# EAGLE design Nebula v1 (EAGLE 6.1)

## Sheet 1 of 5
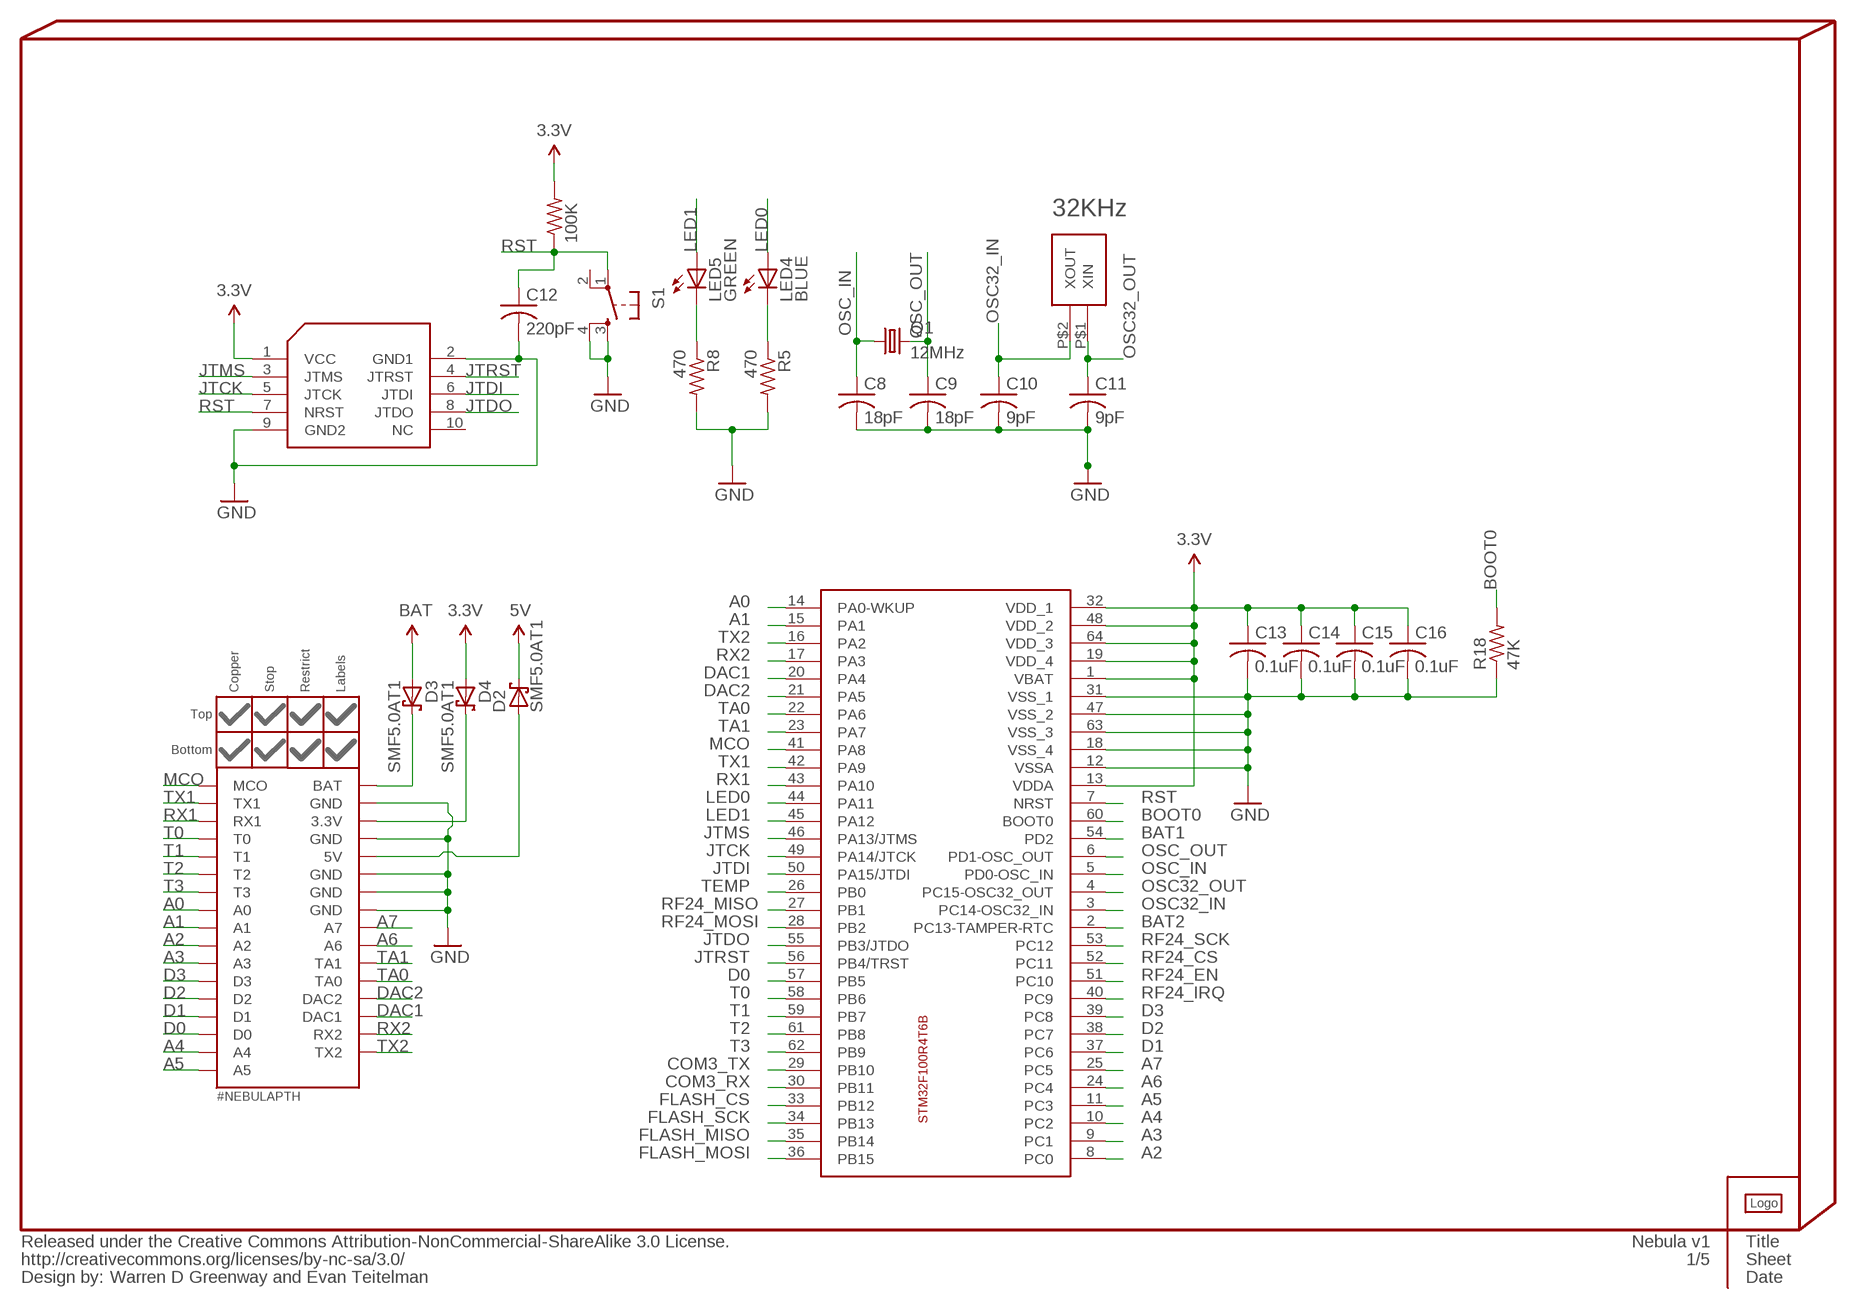
[diagram p0: schematic, sheet 1]

### Parts
C8  18pF  C-USC0402  [C0402]
C9  18pF  C-USC0402  [C0402]
C10  9pF  C-USC0402  [C0402]
C11  9pF  C-USC0402  [C0402]
C12  220pF  C-USC0402  [C0402]
C13  0.1uF  C-USC0402  [C0402]
C14  0.1uF  C-USC0402  [C0402]
C15  0.1uF  C-USC0402  [C0402]
C16  0.1uF  C-USC0402  [C0402]
D2  SMF5.0AT1  [SOD123FL]
D3  SMF5.0AT1  [SOD123FL]
D4  SMF5.0AT1  [SOD123FL]
INFO3  Warren D Greenway and Evan Teitelman  %CC-NC-SA  [%CC-NC-SA]
LED4  BLUE  LED0603  [LED-0603]
LED5  GREEN  LED0603  [LED-0603]
LOGO1  #LOGOA-THICK  [#LOGOA-THICK]
NEBULA1  #NEBULAPTH  [#NEBULA-PTH]
NEBULAPART1  #NEBULA-PARTCOPPER  [#NEBULA-COPPER]
NEBULAPART2  #NEBULA-PARTRESTRICT  [#NEBULA-RESTRICT]
NEBULAPART3  #NEBULA-PARTSTOP  [#NEBULA-STOP]
NEBULAPART4  #NEBULA-PARTLABELS-BOTTOM  [#NEBULA-LABELS-BOTT]
Q1  12MHz  CRYSTAL5X3  [CRYSTAL-SMD-5X3]
Q2  CM415  [CM415]
R3  100K  R-US_R0402  [R0402]
R5  470  R-US_R0402  [R0402]
R8  470  R-US_R0402  [R0402]
R18  47K  R-US_R0402  [R0402]
S1  TAC_SWITCHSMD  [TACTILE_SWITCH_SMD]
U3  STM32F100R4T6B  [S-PQFP64-G64]
U4  STM32-JTAG-10P  [STM32-JTAG-10P]

### Nets
3.3V: C13.1 C14.1 C15.1 C16.1 D4.A R3.2 U3.1(VBAT) U3.13(VDDA) U3.19(VDD_4) U3.32(VDD_1) U3.48(VDD_2) U3.64(VDD_3) U4.1(VCC) ; supply symbol labelled @3.3V ; also sheet 2,3,5
5V: D2.C ; supply symbol labelled @5V ; also sheet 3,4
A0: NEBULA1.A0 U3.14(PA0-WKUP)
A1: NEBULA1.A1 U3.15(PA1)
A2: NEBULA1.A2 U3.8(PC0)
A3: NEBULA1.A3 U3.9(PC1)
A4: NEBULA1.A4 U3.10(PC2)
A5: NEBULA1.A5 U3.11(PC3)
A6: NEBULA1.A6 U3.24(PC4)
A7: NEBULA1.A7 U3.25(PC5)
BAT: D3.A ; supply symbol labelled @BAT ; also sheet 3
BAT1: U3.54(PD2) ; also sheet 3
BAT2: U3.2(PC13-TAMPER-RTC) ; also sheet 3
BOOT0: R18.2 U3.60(BOOT0)
COM3_RX: U3.30(PB11) ; also sheet 4
COM3_TX: U3.29(PB10) ; also sheet 4
D0: NEBULA1.D0 U3.57(PB5)
D1: NEBULA1.D1 U3.37(PC6)
D2: NEBULA1.D2 U3.38(PC7)
D3: NEBULA1.D3 U3.39(PC8)
DAC1: NEBULA1.DAC1 U3.20(PA4)
DAC2: NEBULA1.DAC2 U3.21(PA5)
FLASH_CS: U3.33(PB12) ; also sheet 5
FLASH_MISO: U3.35(PB14) ; also sheet 5
FLASH_MOSI: U3.36(PB15) ; also sheet 5
FLASH_SCK: U3.34(PB13) ; also sheet 5
JTCK: U3.49(PA14/JTCK) U4.5(JTCK)
JTDI: U3.50(PA15/JTDI) U4.6(JTDI)
JTDO: U3.55(PB3/JTDO) U4.8(JTDO)
JTMS: U3.46(PA13/JTMS) U4.3(JTMS)
JTRST: U3.56(PB4/TRST) U4.4(JTRST)
LED0: LED4.A U3.44(PA11)
LED1: LED5.A U3.45(PA12)
MCO: NEBULA1.MCO U3.41(PA8)
N$9: C8.2 C9.2 C10.2 C11.2 C12.2 C13.2 C14.2 C15.2 C16.2 NEBULA1.GND1(GND) NEBULA1.GND2(GND) NEBULA1.GND3(GND) NEBULA1.GND4(GND) NEBULA1.GND5(GND) R5.2 R8.2 R18.1 S1.3 S1.4 U3.12(VSSA) U3.18(VSS_4) U3.31(VSS_1) U3.47(VSS_2) U3.63(VSS_3) U4.2(GND1) U4.9(GND2) ; supply symbol labelled @GND ; also sheet 2,3,4,5
N$16: D3.C NEBULA1.BAT
N$29: D4.C NEBULA1.3.3V
N$35: LED5.C R8.1
N$37: LED4.C R5.1
N$38: D2.A NEBULA1.5V
OSC32_IN: C10.1 Q2.P$2(XOUT) U3.3(PC14-OSC32_IN)
OSC32_OUT: C11.1 Q2.P$1(XIN) U3.4(PC15-OSC32_OUT)
OSC_IN: C8.1 Q1.1 U3.5(PD0-OSC_IN)
OSC_OUT: C9.1 Q1.3 U3.6(PD1-OSC_OUT)
RF24_CS: U3.52(PC11) ; also sheet 2
RF24_EN: U3.51(PC10) ; also sheet 2
RF24_IRQ: U3.40(PC9) ; also sheet 2
RF24_MISO: U3.27(PB1) ; also sheet 2
RF24_MOSI: U3.28(PB2) ; also sheet 2
RF24_SCK: U3.53(PC12) ; also sheet 2
RST: C12.1 R3.1 S1.1 U3.7(NRST) U4.7(NRST)
RX1: NEBULA1.COM1_RX(RX1) U3.43(PA10)
RX2: NEBULA1.COM2_RX(RX2) U3.17(PA3)
T0: NEBULA1.T0 U3.58(PB6)
T1: NEBULA1.T1 U3.59(PB7)
T2: NEBULA1.T2 U3.61(PB8)
T3: NEBULA1.T3 U3.62(PB9)
TA0: NEBULA1.TA0 U3.22(PA6)
TA1: NEBULA1.TA1 U3.23(PA7)
TEMP: U3.26(PB0) ; also sheet 3
TX1: NEBULA1.COM1_TX(TX1) U3.42(PA9)
TX2: NEBULA1.COM2_TX(TX2) U3.16(PA2)
Unconnected: S1.2 U4.10(NC)

## Sheet 2 of 5
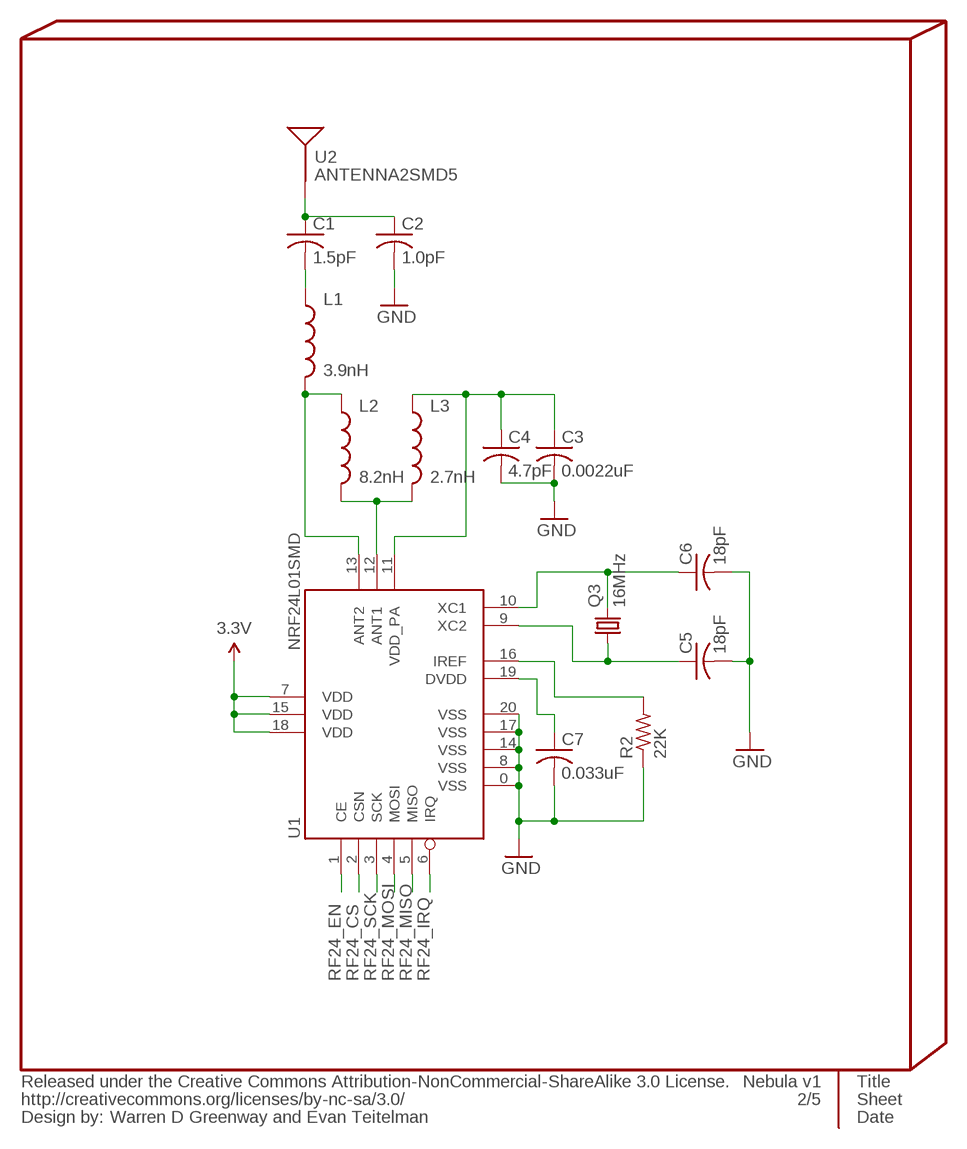
[diagram p1: schematic, sheet 2]

### Parts
C1  1.5pF  C-USC0402  [C0402]
C2  1.0pF  C-USC0402  [C0402]
C3  0.0022uF  C-USC0402  [C0402]
C4  4.7pF  C-USC0402  [C0402]
C5  18pF  C-USC0402  [C0402]
C6  18pF  C-USC0402  [C0402]
C7  0.033uF  C-USC0402  [C0402]
L1  3.9nH  INDUCTOR0402  [C0402]
L2  8.2nH  INDUCTOR0402  [C0402]
L3  2.7nH  INDUCTOR0402  [C0402]
Q3  16MHz  CRYSTAL5X3  [CRYSTAL-SMD-5X3]
R2  22K  R-US_R0402  [R0402]
U1  NRF24L01SMD  [QFN20]
U2  ANTENNA2SMD5  [ANTENNA-CHIP5]

### Nets
3.3V: U1.7(VDD) U1.15(VDD) U1.18(VDD) ; supply symbol labelled @3.3V ; also sheet 1,3,5
N$1: C1.1 C2.1 U2.FEED(SIGNAL)
N$2: C1.2 L1.1
N$3: L1.2 L2.1 U1.13(ANT2)
N$4: L2.2 L3.2 U1.12(ANT1)
N$5: C3.1 C4.1 L3.1 U1.11(VDD_PA)
N$7: C6.1 Q3.3 U1.10(XC1)
N$8: C5.1 Q3.1 U1.9(XC2)
N$9: C2.2 C3.2 C4.2 C5.2 C6.2 C7.2 R2.1 U1.0(VSS) U1.8(VSS) U1.14(VSS) U1.17(VSS) U1.20(VSS) ; supply symbol labelled @GND ; also sheet 1,3,4,5
N$10: R2.2 U1.16(IREF)
N$11: C7.1 U1.19(DVDD)
RF24_CS: U1.2(CSN) ; also sheet 1
RF24_EN: U1.1(CE) ; also sheet 1
RF24_IRQ: U1.6(IRQ) ; also sheet 1
RF24_MISO: U1.5(MISO) ; also sheet 1
RF24_MOSI: U1.4(MOSI) ; also sheet 1
RF24_SCK: U1.3(SCK) ; also sheet 1

## Sheet 3 of 5
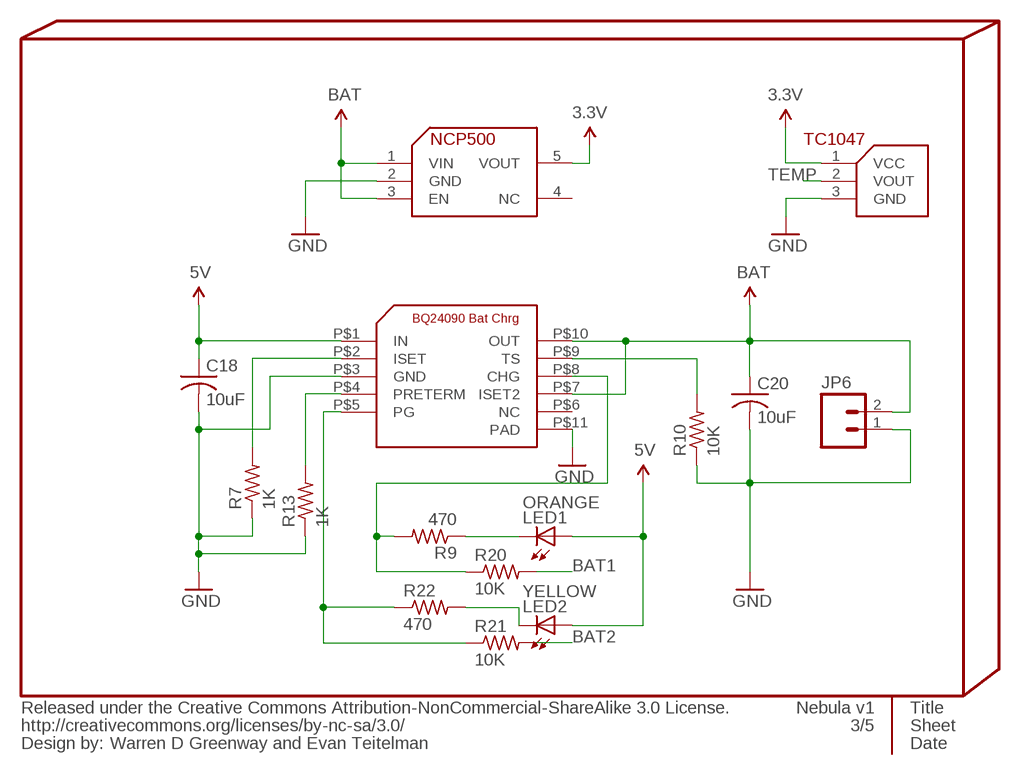
[diagram p2: schematic, sheet 3]

### Parts
C18  10uF  C-USC0805  [C0805]
C20  10uF  C-USC0805  [C0805]
JP6  M02-JST-2MM-SMT  [JST-2-SMD]
LED1  ORANGE  LED0603  [LED-0603]
LED2  YELLOW  LED0603  [LED-0603]
R7  1K  R-US_R0402  [R0402]
R9  470  R-US_R0402  [R0402]
R10  10K  R-US_R0402  [R0402]
R13  1K  R-US_R0402  [R0402]
R20  10K  R-US_R0402  [R0402]
R21  10K  R-US_R0402  [R0402]
R22  470  R-US_R0402  [R0402]
U5  MICROCHIP-TEMP-TC1047  [SOT23]
U6  BQ24090  [R-PDSO-G10]
U8  NCP500  [SOT23-5L]

### Nets
3.3V: U5.1(VCC) U8.5(VOUT) ; supply symbol labelled @3.3V ; also sheet 1,2,5
5V: C18.1 LED1.A LED2.A U6.P$1(IN) ; supply symbol labelled @5V ; also sheet 1,4
BAT: C20.1 JP6.2 U6.P$7(ISET2) U6.P$10(OUT) U8.1(VIN) U8.3(EN) ; supply symbol labelled @BAT ; also sheet 1
BAT1: R20.2 ; also sheet 1
BAT2: R21.2 ; also sheet 1
N$9: C18.2 C20.2 JP6.1 R7.1 R10.1 R13.1 U5.3(GND) U6.P$3(GND) U6.P$11(PAD) U8.2(GND) ; supply symbol labelled @GND, GND ; also sheet 1,2,4,5
N$13: R10.2 U6.P$9(TS)
N$17: R7.2 U6.P$2(ISET)
N$18: R13.2 U6.P$4(PRETERM)
N$27: R21.1 R22.1 U6.P$5(PG)
N$31: R9.2 R20.1 U6.P$8(CHG)
N$32: LED1.C R9.1
N$33: LED2.C R22.2
TEMP: U5.2(VOUT) ; also sheet 1
Unconnected: U6.P$6(NC) U8.4(NC)

## Sheet 4 of 5
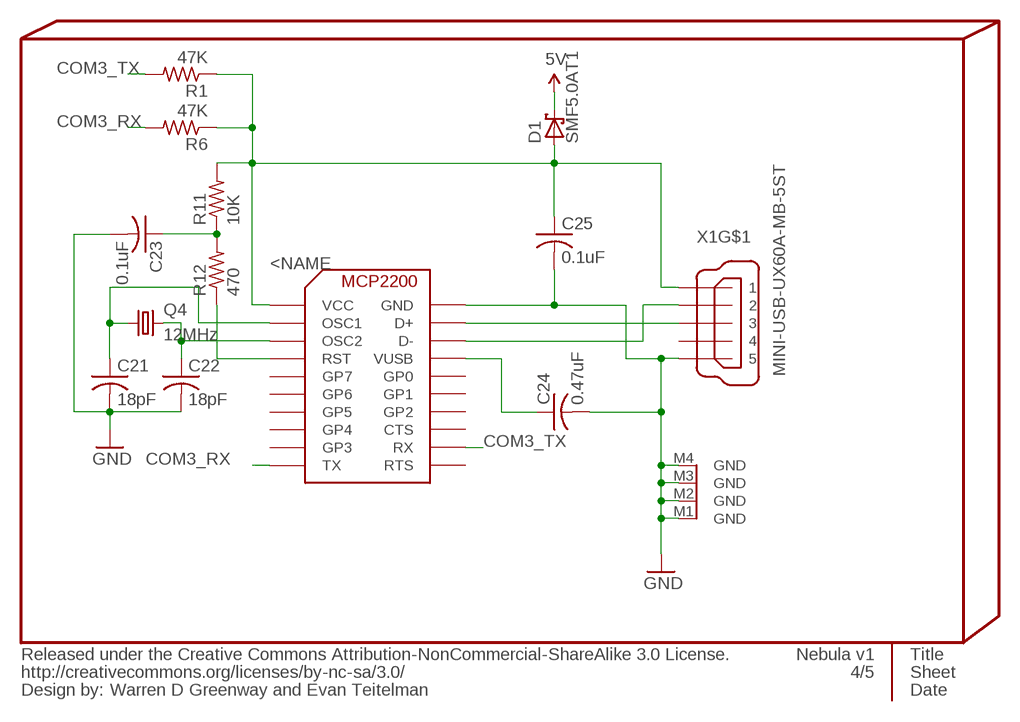
[diagram p3: schematic, sheet 4]

### Parts
C21  18pF  C-USC0402  [C0402]
C22  18pF  C-USC0402  [C0402]
C23  0.1uF  C-USC0402  [C0402]
C24  0.47uF  C-USC0402  [C0402]
C25  0.1uF  C-USC0402  [C0402]
D1  SMF5.0AT1  [SOD123FL]
Q4  12MHz  CRYSTAL5X3  [CRYSTAL-SMD-5X3]
R1  47K  R-US_R0402  [R0402]
R6  47K  R-US_R0402  [R0402]
R11  10K  R-US_R0402  [R0402]
R12  470  R-US_R0402  [R0402]
U7  MICROCHIP-USB-MCP2200  [QFN-20-5X5]
X1  MINI-USB-UX60A-MB-5ST  [UX60A-MB-5ST]

### Nets
5V: D1.C ; supply symbol labelled @5V ; also sheet 1,3
COM3_RX: R6.2 U7.P7(TX) ; also sheet 1
COM3_TX: R1.2 U7.P9(RX) ; also sheet 1
N$9: C21.2 C22.2 C23.2 C24.2 C25.2 U7.P17(GND) X1.5 X1.M1(GND) X1.M2(GND) X1.M3(GND) X1.M4(GND) ; supply symbol labelled @GND ; also sheet 1,2,3,5
N$19: C23.1 R11.1 R12.2
N$21: C22.1 Q4.3 U7.P20(OSC2)
N$22: C21.1 Q4.1 U7.P19(OSC1)
N$24: R12.1 U7.P1(RST)
N$26: U7.P15(D-) X1.2
N$28: C24.1 U7.P14(VUSB)
N$34: C25.1 D1.A R1.1 R6.1 R11.2 U7.P18(VCC) X1.1
N$36: U7.P16(D+) X1.3
Unconnected: U7.P2(GP7) U7.P3(GP6) U7.P4(GP5) U7.P5(GP4) U7.P6(GP3) U7.P8(RTS) U7.P10(CTS) U7.P11(GP2) U7.P12(GP1) U7.P13(GP0) X1.4

## Sheet 5 of 5
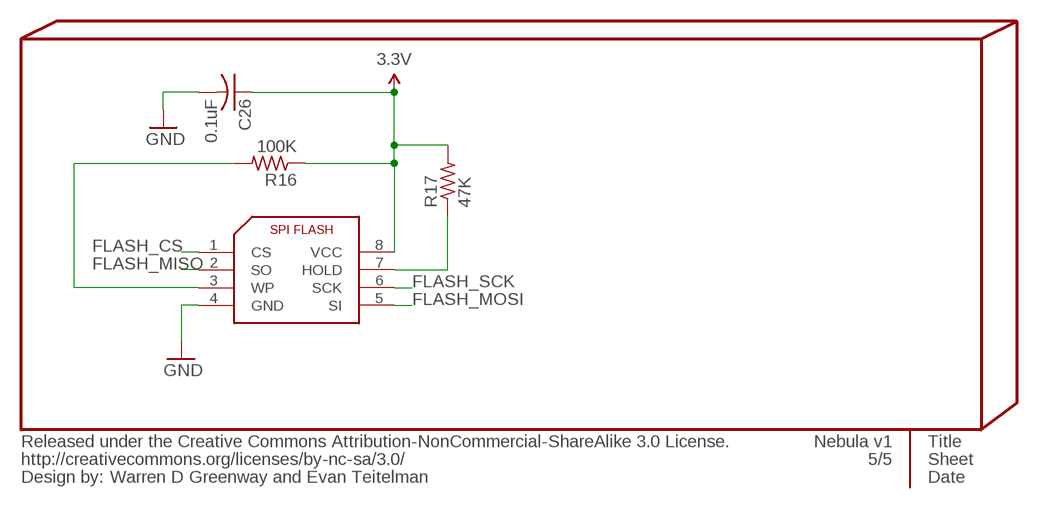
[diagram p4: schematic, sheet 5]

### Parts
C26  0.1uF  C-USC0402  [C0402]
R16  100K  R-US_R0402  [R0402]
R17  47K  R-US_R0402  [R0402]
U9  SST25VF080B  [SOIC8]

### Nets
3.3V: C26.1 R16.1 R17.2 U9.8(VCC) ; supply symbol labelled @3.3V ; also sheet 1,2,3
FLASH_CS: U9.1(CS) ; also sheet 1
FLASH_MISO: U9.2(SO) ; also sheet 1
FLASH_MOSI: U9.5(SI) ; also sheet 1
FLASH_SCK: U9.6(SCK) ; also sheet 1
N$6: R17.1 U9.7(HOLD)
N$9: C26.2 U9.4(GND) ; supply symbol labelled @GND ; also sheet 1,2,3,4
N$30: R16.2 U9.3(WP)

## Library data of the parts
C1-C16 C18 C20-C26 = rcl:C-US: CAPACITOR, American symbol
D1-D4 = diode:SMF5.0AT1: 200 W Transient Voltage Suppressor Source: Data sheet <http://www.onsemi.com/pub_link/Collateral/SMF5.0AT1-D.PDF>
INFO3 = PygmyBoards:%CC-NC-SA: Released under the Creative Commons Attribution-NonCommercial-ShareAlike 3.0 License. http://creativecommons.org/licenses/by-sa/3.0 Design by: [Designer Name] Change this part's value to change the designer name
JP6 = SparkFun:M02: Header 2 Standard 2-pin 0.1" header. Use with straight break away headers (SKU : PRT-00116), right angle break away headers (PRT-00553), swiss pins (PRT-00743), machine pins (PRT-00117), and female headers (PRT-00115). Molex polarized connector foot print use with SKU : PRT-08233 with associated crimp pins and housings.
L1-L3 = SparkFun:INDUCTOR: Inductors Basic Inductor/Choke - 0603 and 1206. Footprints are not proven and vary greatly between part numbers.
LED1 LED2 LED4 LED5 = SparkFun:LED: LEDs Standard schematic elements and footprints for 5mm, 3mm, 1206, and 0603 sized LEDs. 5mm - Spark Fun Electronics SKU : COM-00529 (and others)
LOGO1 = PygmyBoards:#LOGO
NEBULA1 = PygmyBoards:#NEBULA: Nebula Board and Shield Footprint Pads This is the only absolutely required part for the footprint. The parts in "#NEBULA-PART" are merely aesthetic. A circular board outline should be .001" thick and 1.005" in diameter (Reference circle on the Document (48) layer provided).
NEBULAPART1-NEBULAPART4 = PygmyBoards:#NEBULA-PART: Nebula Board and Shield Footprint Parts These parts are only functional when combined with the pads in "#NEBULA".
Q1 Q3 Q4 = SparkFun:CRYSTAL: Crystals Various standard crystals. Proven footprints. Spark Fun Electronics SKU : COM-00534
Q2 = dublib:CM415
R1-R3 R5-R13 R16-R18 R20-R22 = rcl:R-US_: RESISTOR, American symbol
S1 = SparkFun:TAC_SWITCH: Momentary Switch Button commonly used for reset or general input. Spark Fun Electronics SKU : COM-00097
U1 = SparkFun:NRF24L01: 2.4GHz Low Power Transceiver This is the very popular, low cost, very low power RF transceiver from Nordic Semiconductor. Simple SPI interface. SKU: COM-00690
U2 = SparkFun:ANTENNA2: Antenna Single endded antenna. Common with smaller chip antennas. CHIP4 package is the GPS Chip Antenna SKU: GPS-08418. CHIP5 package is 2.4GHz chip antenna SKU: WRL-00144.
U3 = dublib:STM32F100R4T6B
U4 = Pygmy:STM32-JTAG-10P
U5 = dublib:MICROCHIP-TEMP-TC1047
U6 = Pygmy:BQ24090
U7 = dublib:MICROCHIP-USB-MCP2200
U8 = dublib:NCP500
U9 = dublib:SST25VF080B
X1 = dublib:MINI-USB-: MINI USB Connector Source: http://www.hirose.co.jp/cataloge_hp/e24000019.pdf

## Board
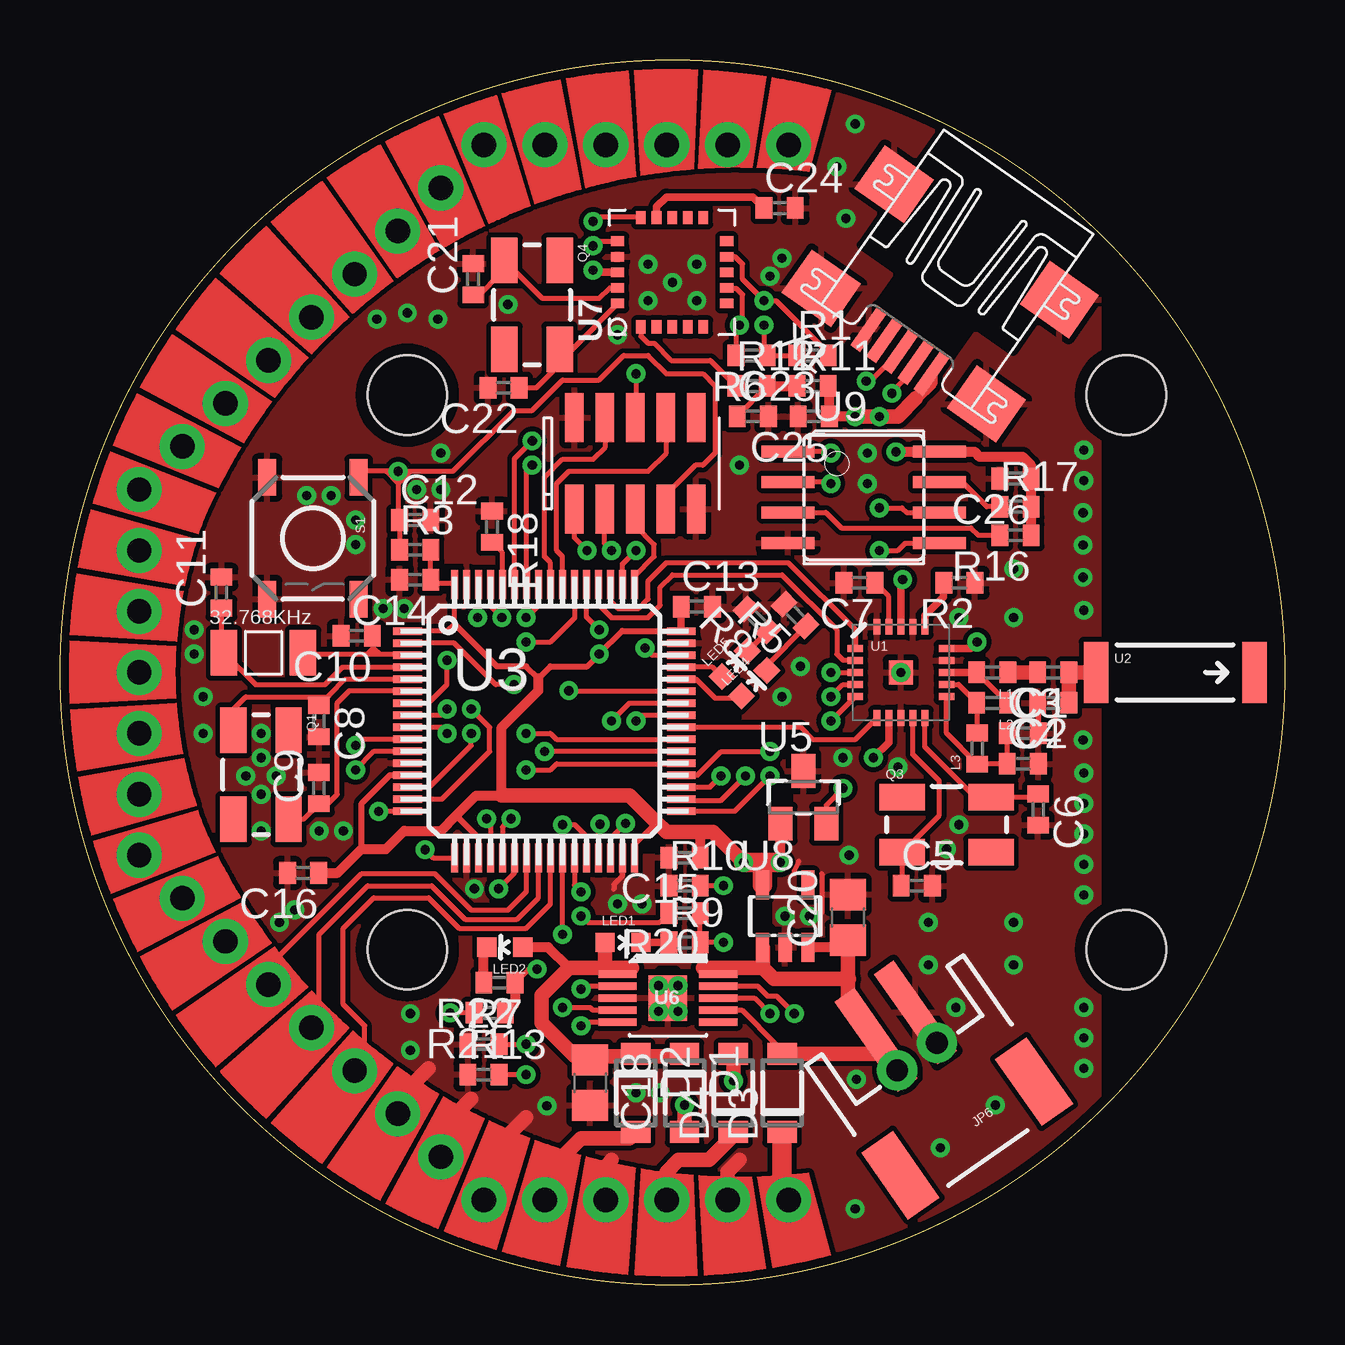
[diagram p5: board, top side]
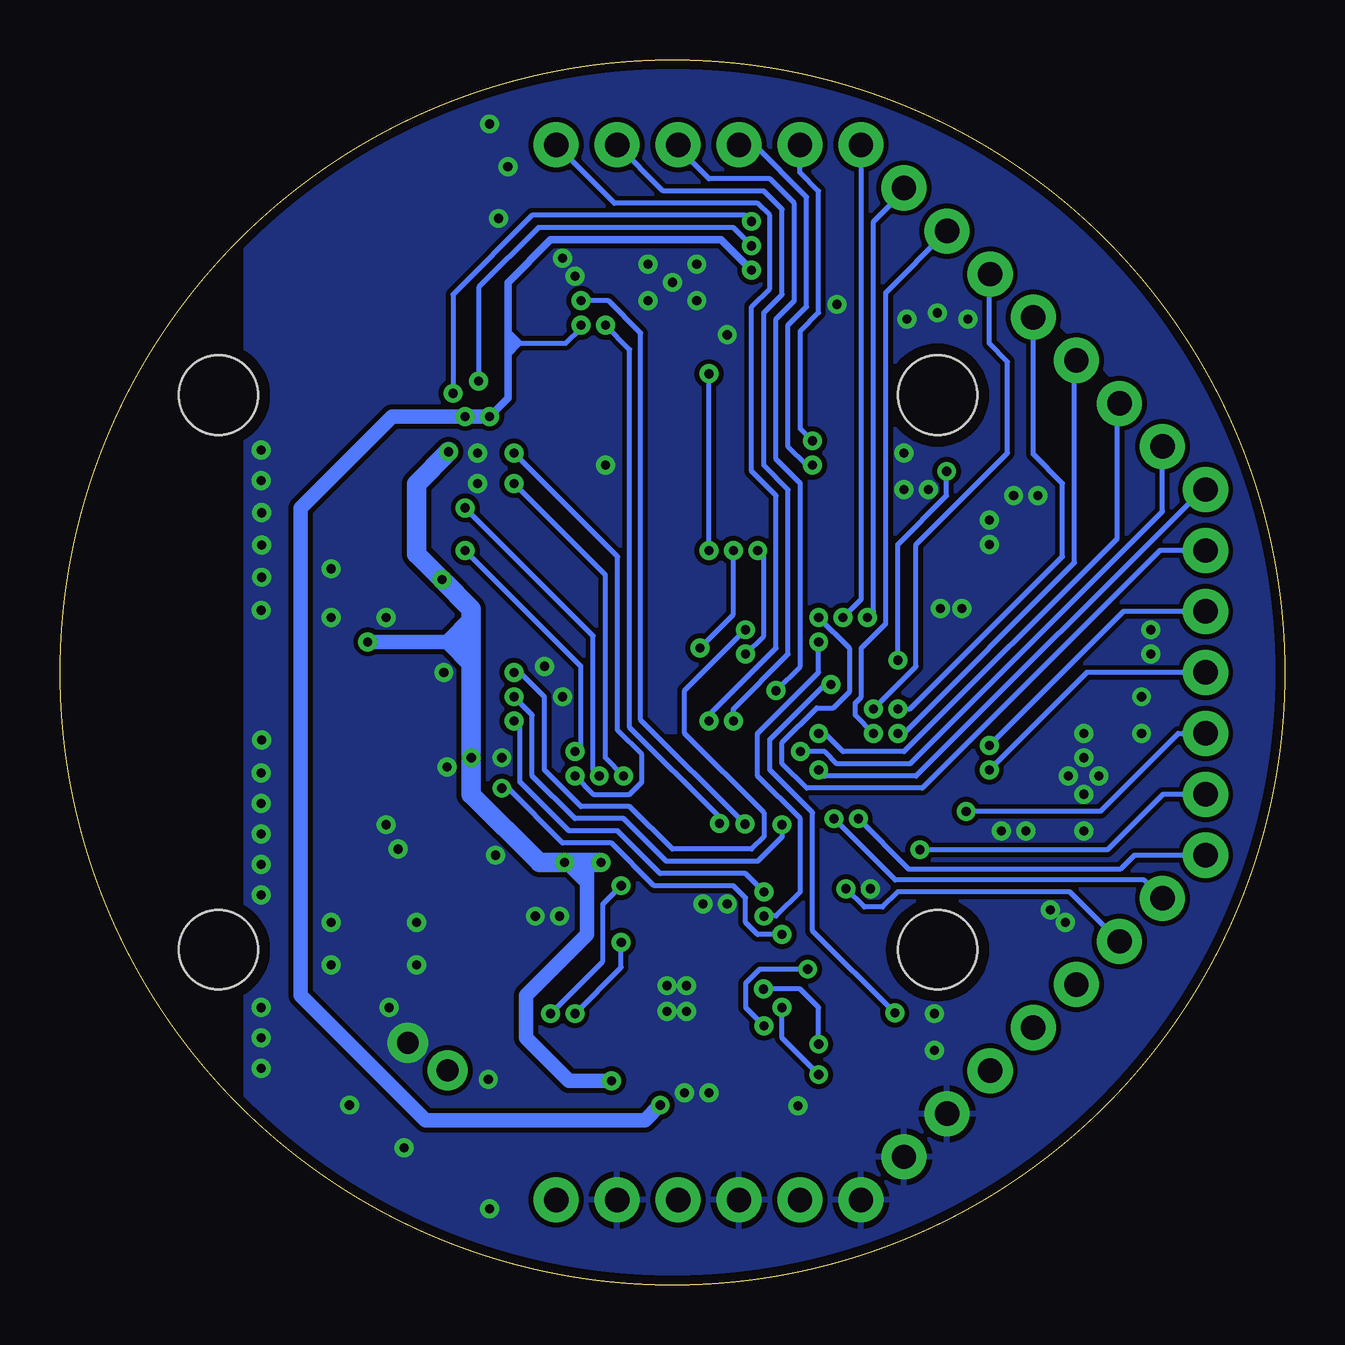
[diagram p6: board, bottom side, seen from below]

Size 51.05 x 51.05 mm. Coordinates in mm from the lower left corner, seen from the top.
Outline: circle at 25.53,25.53 radius 25.53
Copper layers (1*16): Top 0.035mm / dielectric 1.5mm / Bottom 0.035mm
Design rules "PDX (Production)": minimum track width 6mil, minimum drill 15mil, track to track 6mil, track to pad 6mil, pad to pad 4mil, via to via 6mil, smd to smd 4mil, copper to edge 15mil, drill to drill 6mil, minimum pad ring 10mil, minimum via ring 8mil, stop-mask expansion 4mil, vias tented up to drill 25mil, thermal gap 10mil
tRestrict: 9 lines
bRestrict: 3 lines

### Footprints (pad centres in the part's own frame; a part is rotated, then mirrored left to right if it is on the bottom)
C0402 = smd 0.7 x 0.9: 1 -0.65,0; 2 0.65,0
C0805 = smd 1.3 x 1.5: 1 -0.95,0; 2 0.95,0
SOD123FL = smd 0.91 x 1.22: A 1.625,0; C -1.625,0
JST-2-SMD = smd 1 x 4.6: 1 -1,-3.7; 2 1,-3.7 | smd 1.6 x 3.4: NC1 -3.4,1.5; NC2 3.4,1.5
LED-0603 = smd 0.8 x 0.8: A 0,-0.75; C 0,0.75
#NEBULA-PTH@1 = drill 1.016 pad 1.88 round: 3.3V -25.637,-47.388; 5V -30.716,-47.388; A0 -36.848,-7.004; A1 -38.645,-8.8; A2 -40.44,-10.596; A3 -42.237,-12.392; A4 -47.625,-22.86; A5 -47.625,-25.4; A6 -40.44,-40.204; A7 -38.645,-42; BAT -20.557,-47.388; COM1_RX -25.636,-3.412; COM1_TX -23.096,-3.412; COM2_RX -47.625,-30.48; COM2_TX -47.625,-27.94; D0 -47.625,-20.32; D1 -47.625,-17.78; D2 -45.829,-15.984; D3 -44.032,-14.188; DAC1 -47.625,-33.02; DAC2 -45.829,-34.816; GND1 -36.848,-43.796; GND2 -35.052,-45.592; GND3 -33.256,-47.388; GND4 -28.177,-47.388; GND5 -23.097,-47.388; MCO -20.556,-3.412; T0 -28.176,-3.412; T1 -30.716,-3.412; T2 -33.256,-3.412; T3 -35.052,-5.208; TA0 -44.032,-36.612; TA1 -42.237,-38.408
CRYSTAL-SMD-5X3 = smd 1.9 x 1.1: 1 -1.85,-1.15; 2 1.85,-1.15; 3 1.85,1.15; 4 -1.85,1.15
CM415 = smd 1.1 x 1.9: P$1 0,0; P$2 3.3,0
R0402 = smd 0.7 x 0.9: 1 -0.65,0; 2 0.65,0
TACTILE_SWITCH_SMD = smd 1.524 x 0.762: 1 -2.54,1.905; 2 2.54,1.905; 3 -2.54,-1.905; 4 2.54,-1.905
QFN20 = smd 1 x 1: 0 0,0 | smd 0.65 x 0.3: 1 -1.9,1; 2 -1.9,0.5; 3 -1.9,0; 4 -1.9,-0.5; 5 -1.9,-1; 11 1.9,-1; 12 1.9,-0.5; 13 1.9,0; 14 1.9,0.5; 15 1.9,1 | smd 0.3 x 0.65: 6 -1,-1.9; 7 -0.5,-1.9; 8 0,-1.9; 9 0.5,-1.9; 10 1,-1.9; 16 1,1.9; 17 0.5,1.9; 18 0,1.9; 19 -0.5,1.9; 20 -1,1.9
ANTENNA-CHIP5 = smd 1.016 x 2.54: FEED -3.302,0; NC 3.302,0
S-PQFP64-G64 = smd 1.2 x 0.3: 1 -5.7,3.75; 2 -5.7,3.25; 3 -5.7,2.75; 4 -5.7,2.25; 5 -5.7,1.75; 6 -5.7,1.25; 7 -5.7,0.75; 8 -5.7,0.25; 9 -5.7,-0.25; 10 -5.7,-0.75; 11 -5.7,-1.25; 12 -5.7,-1.75; 13 -5.7,-2.25; 14 -5.7,-2.75; 15 -5.7,-3.25; 16 -5.7,-3.75; 33 5.7,-3.75; 34 5.7,-3.25; 35 5.7,-2.75; 36 5.7,-2.25; 37 5.7,-1.75; 38 5.7,-1.25; 39 5.7,-0.75; 40 5.7,-0.25; 41 5.7,0.25; 42 5.7,0.75; 43 5.7,1.25; 44 5.7,1.75; 45 5.7,2.25; 46 5.7,2.75; 47 5.7,3.25; 48 5.7,3.75 | smd 0.3 x 1.2: 17 -3.75,-5.7; 18 -3.25,-5.7; 19 -2.75,-5.7; 20 -2.25,-5.7; 21 -1.75,-5.7; 22 -1.25,-5.7; 23 -0.75,-5.7; 24 -0.25,-5.7; 25 0.25,-5.7; 26 0.75,-5.7; 27 1.25,-5.7; 28 1.75,-5.7; 29 2.25,-5.7; 30 2.75,-5.7; 31 3.25,-5.7; 32 3.75,-5.7; 49 3.75,5.7; 50 3.25,5.7; 51 2.75,5.7; 52 2.25,5.7; 53 1.75,5.7; 54 1.25,5.7; 55 0.75,5.7; 56 0.25,5.7; 57 -0.25,5.7; 58 -0.75,5.7; 59 -1.25,5.7; 60 -1.75,5.7; 61 -2.25,5.7; 62 -2.75,5.7; 63 -3.25,5.7; 64 -3.75,5.7
STM32-JTAG-10P = smd 0.762 x 2.032: 1 0,0; 2 0,3.81; 3 1.27,0; 4 1.27,3.81; 5 2.54,0; 6 2.54,3.81; 7 3.81,0; 8 3.81,3.81; 9 5.08,0; 10 5.08,3.81
SOT23 = smd 1 x 1.4: 1 -0.95,-1.1; 2 0.95,-1.1; 3 0,1.1
R-PDSO-G10 = smd 0.3 x 1.6: P$1 0,0; P$2 0.5,0; P$3 1,0; P$4 1.5,0; P$5 2,0; P$6 2,4.2; P$7 1.5,4.2; P$8 1,4.2; P$9 0.5,4.2; P$10 0,4.2 | smd 1.9 x 1.6: P$11 1,2.1
QFN-20-5X5 = smd 0.55 x 0.4: P1 0,-0.975; P2 0,-1.625; P3 0,-2.275; P4 0,-2.925; P5 0,-3.575; P11 4.55,-3.575; P12 4.55,-2.925; P13 4.55,-2.275; P14 4.55,-1.625; P15 4.55,-0.975 | smd 0.4 x 0.55: P6 0.975,-4.55; P7 1.625,-4.55; P8 2.275,-4.55; P9 2.925,-4.55; P10 3.575,-4.55; P16 3.575,0; P17 2.925,0; P18 2.275,0; P19 1.625,0; P20 0.975,0
SOT23-5L = smd 0.55 x 1.2: 1 -0.95,-1.3; 2 0,-1.3; 3 0.95,-1.3; 4 0.95,1.3; 5 -0.95,1.3
SOIC8@1 = smd 0.5 x 2.2: 1 -1.905,-3.154; 2 -0.645,-3.154; 3 0.625,-3.154; 4 1.895,-3.154; 5 1.905,3.154; 6 0.635,3.154; 7 -0.635,3.154; 8 -1.905,3.154
STAND-OFF = hole 3.302: 0,0
UX60A-MB-5ST = smd 2 x 0.5: 1 2.25,1.6; 2 2.25,0.8; 3 2.25,0; 4 2.25,-0.8; 5 2.25,-1.6 | smd 2.2 x 2.5: M1 -3.3,-4.2; M2 -3.3,4.2; M3 2,4.2; M4 2,-4.2

### Placement (x,y rotation side)
C1  41.4,25.53 180 top
C2  41.4,24.26 180 top
C3  40.13,22.99 0 top
C4  40.13,21.72 0 top
C5  35.71,16.64 0 top
C6  40.77,19.81 270 top
C7  33.32,29.26 180 top
C8  10.79,23.5 270 top
C9  10.79,20.7 90 top
C10  12.37,27.05 180 top
C11  6.73,28.85 90 top
C12  14.81,31.88 0 top
C13  26.54,28.27 0 top
C14  14.81,29.39 180 top
C15  26.04,17.81 180 top
C16  10.13,17.17 180 top
C18  22.1,8.43 270 top
C20  32.84,15.32 90 top
C21  17.22,41.91 90 top
C22  18.49,37.39 180 top
C23  28.88,36.19 0 top
C24  30,44.88 0 top
C25  31.42,36.19 180 top
C26  39.83,33.6 180 top
D1  26.04,8 270 top
D2  24,8 270 top
D3  30.1,8 90 top
D4  28.07,8 90 top
INFO3  -2.67,-9.27 0 top  (outside the outline)
JP6  36.96,7.75 215 top
L1  38.86,25.53 180 top
L2  38.86,24.26 180 top
L3  38.23,22.35 90 top
LED1  23.47,14.27 270 top
LED2  18.54,14.07 90 top
LED4  28.93,25.07 315 top
LED5  28.12,25.88 315 top
LOGO1  34.42,25.53 90 bottom
NEBULA1  #NEBULAPTH  [#NEBULA-PTH@1]  50.93,50.93 0 top
NEBULAPART1  50.93,50.93 0 top
NEBULAPART2  50.93,50.93 0 top
NEBULAPART3  50.93,50.93 0 top
NEBULAPART4  50.93,50.93 0 top
Q1  8.38,21.26 270 top
Q2  6.83,26.34 0 top
Q3  36.96,19.18 0 top
Q4  19.68,40.84 270 top
R1  31.37,38.73 0 top
R2  37.49,29.26 180 top
R3  14.81,30.63 0 top
R5  30.64,27.91 135 top
R6  28.83,38.73 180 top
R7  17.65,10.03 0 top
R8  29.05,27.71 135 top
R9  26.04,14.27 0 top
R10  26.04,16.64 0 top
R11  31.37,37.47 0 top
R12  28.83,37.47 0 top
R13  17.65,8.76 0 top
R16  39.83,31.24 180 top
R17  39.83,32.44 0 top
R18  18.01,31.6 270 top
R20  26.04,15.49 180 top
R21  17.91,11.34 180 top
R22  18.31,12.6 180 top
S1  10.54,31.11 270 top
U1  35.05,25.53 0 top
U2  46.48,25.53 0 top
U3  20.19,23.5 0 top
U4  21.44,32.33 0 top
U5  30.99,20.32 0 top
U6  23.24,12.95 270 top
U7  23.24,39.93 90 top
U8  30.23,15.37 0 top
U9  SST25VF080B  [SOIC8@1]  33.5,32.82 270 top
U$1  [STAND-OFF]  14.48,37.08 0 top
U$2  [STAND-OFF]  14.48,13.97 0 top
U$3  [STAND-OFF]  44.45,37.08 0 top
U$4  [STAND-OFF]  44.45,13.97 0 top
X1  36.32,40.77 235 top

### Tracks (layer width: path | path; a pad name or v marks a point on that pad's centre or on a via)
3.3V  (via drill 0.38)
  Top 0.203: U3.1 16.14,27.25 16.44,27.55 U3.64 16.44,29.23 15.62,29.23 C14.1 R3.2 | U3.32 23.94,18.36 24.87,19.28 | 29.28,17.36 29.28,17.59 29.32,17.59 29.34,17.6 | U4.1 21.44,31.14 v21.97,30.61
  Top 0.254: U3.13 13.75,21.25 12.57,20.07 12.57,18.16 | 25.88,27.25 23.44,27.25 v22.48,26.29 21.97,25.78 20.45,25.78 19.94,25.27 19.43,25.78 18.21,25.78 16.44,27.55 | U3.19 17.44,18.62 16.51,19.56
  Top 0.305: C13.1 U3.48 25.88,27.25 | U1.7 34.55,22.61 v33.91,21.97 | U1.18 35.05,29.32 v35.12,29.39 | U1.15 37.96,26.53 v38.23,26.8
  Top 0.406: v34.85,34.72 U9.8 38.12,34.72 38.33,34.52 40.13,34.52 40.46,34.19 40.46,33.62 C26.1 R17.2 R16.1 | 19.94,25.27 19.94,24.77 18.41,23.24 18.41,20.4 17.35,20.4 16.51,19.56 15.88,18.92 14.35,18.92 13.59,18.16 12.57,18.16 11.58,17.17 C16.1 | C15.1 26.68,18.73 26.54,18.87 | U5.1 30.04,17.62 v30.02,17.6
  Top 0.61: v28.07,8.51 D4.A | 18.41,20.4 23.75,20.4 24.87,19.28 25.27,18.87 26.54,18.87 27.23,18.87 v28.5,17.6
  Top 0.813: v28.5,17.6 29.34,17.6 v30.02,17.6 | 29.28,17.36 U8.5
  Bottom 0.203: v22.48,26.29 21.72,27.05 21.72,30.35 v21.97,30.61 | 29.01,17.6 29.08,17.53
  Bottom 0.406: 29.08,16.64 30.1,17.65
  Bottom 0.61: 33.91,26.8 34.92,26.8 | 34.92,26.8 v38.23,26.8 | v28.07,8.51 29.85,8.51 31.62,10.29 31.62,12.06 29.08,14.61 29.08,16.64 29.08,17.53 | 34.92,26.8 33.91,27.81 | 33.91,25.78 34.92,26.8
  Bottom 0.813: v28.5,17.6 29.01,17.6 v30.02,17.6 31.06,17.6 33.91,20.45 v33.91,21.97 33.91,25.78 33.91,26.8 33.91,27.81 33.91,28.18 v35.12,29.39 36.19,30.46 36.19,33.39 v34.85,34.72
5V
  Top 0.203: 22.24,9.53 23.9,9.53 D2.C | D1.C 26.06,9.63 26.22,9.78 | 22.86,13.21 22.99,13.21 U6.P$1
  Top 0.254: 21.95,9.53 21.82,9.65
  Top 0.406: LED2.A 20.34,14.07 21.21,13.21
  Top 0.61: 26.22,9.78 26.22,9.58 | D1.C 25.93,9.53 22.24,9.53 C18.1 21.95,9.53 21.46,9.53 20.07,10.92 20.07,12.06 21.21,13.21 22.73,13.21 | 22.73,13.21 22.86,13.21 23.85,13.21 | LED1.A 22.72,13.22 22.73,13.21
A0  (via drill 0.38)
  Top 0.203: 14.85,20.75 U3.14 15.41,20.75 17.14,22.48 v17.14,22.99
  Bottom 0.203: v17.14,22.99 17.91,23.75 17.91,24.26 17.65,24.51 17.65,26.54 16.64,27.56 16.64,41.36 NEBULA1.A0
A1  (via drill 0.38)
  Top 0.203: v17.14,24 17.91,23.24 17.91,22.23 15.93,20.25 U3.15
  Bottom 0.203: v17.14,24 15.37,25.78 15.37,30.86 11.56,34.67 11.56,38.48 12.32,39.24 12.32,42.09 NEBULA1.A1
A2  (via drill 0.38)
  Top 0.203: U3.8 15.87,23.75 v16.13,24
  Bottom 0.203: NEBULA1.A2 10.49,34.62 9.27,33.4 9.27,30.35 15.62,24 v16.13,24
A3  (via drill 0.38)
  Top 0.203: U3.9 15.87,23.25 v16.13,22.99
  Bottom 0.203: NEBULA1.A3 8.76,38.46 8.76,30.1 15.88,22.99 v16.13,22.99
A4  (via drill 0.38)
  Top 0.203: U3.10 12.58,22.75 v12.32,22.48
  Bottom 0.203: v12.32,22.48 6.73,28.07 NEBULA1.A4
A5  (via drill 0.38)
  Top 0.203: U3.11 13.1,22.25 v12.32,21.46
  Bottom 0.203: v12.32,21.46 8.25,25.53 NEBULA1.A5
A6
  Top 0.203: U3.24 19.94,16.13 19.05,15.24 16.89,15.24 15.49,16.64 12.83,16.64 10.79,14.61 10.79,11.03 NEBULA1.A6
A7
  Top 0.203: U3.25 20.44,15.87 19.43,14.86 16.64,14.86 15.37,16.13 13.08,16.13 11.81,14.86 11.81,11.68 12.7,10.79 12.7,9.34 NEBULA1.A7
BAT  (via drill 0.9 pad 1.68)
  Top 0.203: JP6.2 34.42,9.8 34.42,9.42 v34.9,8.94 | 32.88,12.75 32.88,12.06 32.88,11.85 32.84,11.89 | 33.02,11.94 33,11.94 | 29.85,9.78 29.95,9.78 D3.A 29.85,9.88 29.85,10.03 28.42,11.45 U6.P$7 | U6.P$10 27.19,13.21 27.06,13.21 | 29.3,14.04 U8.1
  Top 0.305: JP6.2 34.02,10.64
  Top 0.406: U8.3 32.54,14.07 C20.1
  Top 0.61: C20.1 32.84,12.06 32.88,12.06 32.89,12.06 33.02,11.94 33.02,11.68 33.53,11.18 33.53,10.79 34.02,10.31 JP6.2 | 29.3,13.21 27.06,13.21 26.8,13.21 | D3.A 34.21,9.63 v34.9,8.94 | 32.88,12.75 29.76,12.75 29.3,13.21 | 29.3,13.21 29.3,14.04
BAT1  (via drill 0.38)
  Top 0.203: U3.54 21.46,29.18 21.46,27.81 20.45,26.8 v19.43,26.8 | R20.2 25,15.11 21.97,15.11 v21.72,15.37
  Bottom 0.203: v19.43,26.8 19.43,25.53 21.97,22.99 21.97,21.21 20.19,19.43 20.19,16.38 21.21,15.37 v21.72,15.37
BAT2  (via drill 0.38)
  Top 0.203: U3.2 16.43,26.75 18.16,25.02 v18.92,25.02 | v16.26,11.33 17.25,11.33 R21.2
  Bottom 0.203: v18.92,25.02 19.18,25.02 21.46,22.73 21.46,21.46 19.68,19.68 19.68,14.76 v16.26,11.33
BOOT0
  Top 0.203: U3.60 18.44,30.51 R18.2
COM3_RX  (via drill 0.38)
  Top 0.203: U7.P7 27.82,41.53 28.19,41.53 28.45,41.28 28.45,40.13 v28.32,40 28.18,39.86 R6.2 | U3.30 22.94,18.6 v23.57,19.23
  Bottom 0.203: v23.57,19.23 23.62,19.28 23.62,19.56 27.3,23.24 27.3,38.99 v28.32,40
COM3_TX  (via drill 0.38)
  Top 0.203: U7.P9 28.14,42.85 28.45,42.55 28.45,41.91 v29.34,41.02 29.85,41.02 31.88,38.99 31.88,38.88 R1.2 | U3.29 22.44,19.14 v22.5,19.2
  Bottom 0.203: v22.5,19.2 26.85,23.55 26.85,39.67 28.19,41.02 v29.34,41.02
D0  (via drill 0.38)
  Top 0.203: U3.57 19.94,28.32 v19.43,27.81
  Bottom 0.203: NEBULA1.D0 5.21,30.61 15.11,20.7 19.94,20.7 20.95,21.72 20.95,22.61 19.51,24.05 18.82,24.05 18.14,24.74 18.14,26.52 v19.43,27.81
D1  (via drill 0.38)
  Top 0.203: U3.37 25.86,21.72 20.7,21.72 20.45,21.46 v19.43,21.46
  Bottom 0.203: 3.43,33.15 15.37,21.21 19.18,21.21 v19.43,21.46 | NEBULA1.D1 3.43,33.15 | 3.43,33.15
D2  (via drill 0.38)
  Top 0.203: U3.38 20.22,22.25 v20.19,22.23
  Bottom 0.203: v20.19,22.23 19.18,22.23 18.67,21.72 15.62,21.72 5.1,32.24 NEBULA1.D2
D3  (via drill 0.38)
  Top 0.203: U3.39 25.88,22.73 20.7,22.73 20.45,22.99 v19.43,22.99
  Bottom 0.203: v19.43,22.99 19.18,22.99 18.41,22.23 15.88,22.23 6.98,31.11 6.98,36.65 NEBULA1.D3
DAC1  (via drill 0.38)
  Top 0.203: U3.20 17.94,19.27 v17.78,19.43
  Bottom 0.203: NEBULA1.DAC1 6.27,17.91 6.86,17.32 15.67,17.32 v17.78,19.43
DAC2  (via drill 0.38)
  Top 0.203: U3.21 18.44,19.08 v18.8,19.43
  Bottom 0.203: NEBULA1.DAC2 5.86,16.87 16.24,16.87 v18.8,19.43
FLASH_CS  (via drill 0.38)
  Top 0.203: U3.33 28.13,19.75 v29.59,21.21 | U9.1 32.08,34.72 v32.13,34.67
  Bottom 0.203: v29.59,21.21 28.83,20.45 27.3,20.45 26.8,20.95 26.8,22.1 27.81,23.11 27.81,30.35 v32.13,34.67
FLASH_MISO  (via drill 0.38)
  Top 0.203: U3.35 27.09,20.75 v27.56,21.21 | U9.2 32.07,33.46 v32.13,33.4
  Bottom 0.203: v27.56,21.21 28.32,21.97 28.32,29.59 v32.13,33.4
FLASH_MOSI  (via drill 0.38)
  Top 0.203: U3.36 26.58,21.25 27.56,22.23 v29.59,22.23 | U9.5 35.23,30.91 34.92,30.61 v34.16,30.61
  Bottom 0.203: v29.59,22.23 29.34,22.48 29.34,25.78 v34.16,30.61
FLASH_SCK  (via drill 0.38)
  Top 0.203: U3.34 25.95,20.19 27.56,20.19 v28.57,21.21 | U9.6 35.31,32.18 35.1,32.39 v34.16,32.39
  Bottom 0.203: v28.57,21.21 28.83,21.46 28.83,27.05 v34.16,32.39
JTCK
  Top 0.203: 23.93,29.18 U3.49 23.94,29.53 24.77,30.35 24.77,30.86 24,31.62 24,32.31 U4.5
JTDI  (via drill 0.38)
  Top 0.203: U3.50 23.44,30.05 v24,30.61 | v24,37.97 24,36.17 U4.6
  Bottom 0.203: v24,30.61 v24,37.97
JTDO
  Top 0.203: U3.55 20.94,30.36 20.7,30.61 20.7,33.4 21.21,33.91 24.51,33.91 25.27,34.67 25.27,36.12 U4.8
JTMS  (via drill 0.38)
  Top 0.203: 22.73,32.31 U4.3 22.71,30.89 v22.99,30.61 | U3.46 24.68,26.25 v24.38,26.54
  Bottom 0.203: v22.99,30.61 22.99,27.94 v24.38,26.54
JTRST
  Top 0.203: U3.56 20.44,30.1 20.19,30.35 20.19,33.66 20.95,34.42 22.23,34.42 22.73,34.92 22.73,36.12 U4.4 | U4.4 22.71,36.3 22.73,36.32 22.73,36.37 | U4.4 22.71,35.53
LED0
  Top 0.203: U3.44 26.52,25.25 27.3,24.46 28.32,24.46 LED4.A
LED1
  Top 0.203: U3.45 27.2,25.75 LED5.A
MCO  (via drill 0.38)
  Top 0.203: U3.41 25.79,23.75 25.78,23.75 24.26,23.75 v24,23.5
  Bottom 0.203: NEBULA1.MCO 27.94,45.08 21.97,45.08 21.46,44.58 21.46,41.53 22.23,40.77 22.23,33.91 21.21,32.89 21.21,26.54 24,23.75 v24,23.5
N$1
  Top 0.61: U2.FEED C1.1 C2.1
N$2
  Top 0.61: L1.1 C1.2
N$3
  Top 0.203: 38.21,25.56 L1.2 38.23,25.53 L2.1
  Top 0.305: L1.2 U1.13
N$4
  Top 0.203: U1.12 37.46,25.03 38.23,24.26 L2.2 38.21,23.02 L3.2
N$5
  Top 0.203: C3.1 C4.1 39.47,21.7 L3.1 36.95,22.99 U1.11
N$6
  Top 0.203: U9.7 37.62,33.45 38.63,32.44 R17.1
N$7
  Top 0.203: C6.1 40.63,20.33 Q3.3 38.74,20.4 38.08,20.4 36.05,22.42 U1.10
N$8
  Top 0.203: U1.9 35.55,22.11 36.65,21.01 36.65,19.57 Q3.1 35.11,16.68 C5.1
N$9  (via drill 0.38, 0.9 pad 1.68)
  Top 0.203: 31.75,17.14 31.75,15.49 | C3.2 40.78,24.23 C2.2 | U3.31 23.44,17.04 23.09,16.69 23.09,16.48 | 30.61,17.14 30.61,17.27 30.8,17.65
  Top 0.61: NEBULA1.GND1 14.08,7.73 15.37,9.02 | NEBULA1.GND4 22.75,4.97 22.99,5.21 | NEBULA1.GND5 27.83,4.72 28.32,5.21 | NEBULA1.GND3 17.67,4.72 18.41,5.46 18.41,5.97 19.43,6.98 | NEBULA1.GND2 15.88,6.48 17.14,7.75
  Top 1.016: NEBULA1.GND1 14.08,7.17
  other vias: 32.64,21.97 39.75,15.11 33.66,34.67 42.65,29.49 42.67,34.8 42.67,33.53 39.75,29.85 42.65,32.18 26.54,41.02 14.35,28.19 12.32,31.88 33.15,3.17 42.65,22.71 42.67,21.34 42.67,20.07 42.67,18.8 42.67,17.53 42.67,16.26 42.67,10.29 42.67,11.56 42.67,9.02 30.23,15.37 30.1,24.51 39.75,27.81 37.47,27.81 20.29,7.47 14.61,9.78 37.34,11.56 31.24,15.37 28.32,34.16 11.3,32.89 36.19,15.11 24.26,15.88 9.14,15.11 36.7,5.71 32.89,17.91 23.24,39.6 25.02,8 35.05,25.53 36.96,18.16 25.76,11.4 33.2,8.56 38.99,7.49 9.78,15.62 24.94,12.47 13.21,40.26 32.77,44.45 5.59,27.3 24.51,42.55 25.53,41.78 24.51,41.02 26.54,42.55 42.65,30.84 32.39,46.61 39.75,13.33 34.92,21.59 30.86,25.78 33.15,48.39 10.29,32.89 15.75,40.26 24,8 42.67,28.12 30.1,42.8 29.59,42.04 36.55,10.08 8.38,18.92 23.24,15.88 5.97,22.99 11.81,18.92 24.94,11.4 25.76,12.47 14.48,40.51 10.79,18.92 14.61,11.3 37.47,19.18 33.66,33.4 18.67,40.87 15.88,34.67 15.88,33.15 14.86,33.15 12.32,30.86 17.27,16.51 8.38,20.45 36.19,13.33 7.75,21.21 8.38,21.97 8.38,22.99 9.02,21.21 5.59,26.29 13.46,28.19 5.97,24.51
  pour Top (isolate 0.203): -1.14,52.2 43.31,52.2 43.31,-1.14 -1.14,-1.14
  pour Bottom (isolate 0.203): -2.41,53.47 43.31,53.47 43.31,-2.41 -2.41,-2.41
N$10
  Top 0.305: U1.16 36.05,27.9 36.83,28.68 R2.2
N$11
  Top 0.203: U1.19 34.55,28.68 C7.1
N$13  (via drill 0.38)
  Top 0.203: v27.66,16.64 R10.2 | U6.P$9 29.07,12.45 29.49,12.04 29.87,12.04 v30.61,11.3
  Bottom 0.203: v30.61,11.3 28.42,13.49 28.42,15.88 v27.66,16.64
N$16
  Top 0.813: D3.C 30.1,3.81 NEBULA1.BAT
N$17  (via drill 0.38)
  Top 0.203: R7.2 v19.43,10.03 | U6.P$2 21.85,12.45 v21.73,12.33
  Bottom 0.203: v19.43,10.03 19.43,11.56 20.2,12.33 v21.73,12.33
N$18  (via drill 0.38)
  Top 0.203: R13.2 v19.43,8.76 | U6.P$4 22.2,11.45 22.1,11.56 v20.95,11.56
  Bottom 0.203: v20.95,11.56 20.95,10.29 v19.43,8.76
N$19
  Top 0.203: C23.1 28.23,36.22 R12.2
  Top 0.406: R12.2 R11.1
N$21
  Top 0.203: U7.P20 21.34,38.99 Q4.3 20.83,38.35 19.86,37.39 C22.1
N$22
  Top 0.203: U7.P19 22.91,41.55 22.48,41.12 20.1,41.12 Q4.1 18.36,42.53 18.36,42.14 17.49,41.26 C21.1
N$24
  Top 0.203: 24.22,39.79 U7.P1 24.22,39.54 24.51,39.24 24.77,39.24 25.48,38.53 27.11,38.53 R12.1
N$26  (via drill 0.38)
  Top 0.203: v34.67,37.16 34.92,37.41 34.92,37.47 35.69,38.23 X1.2 | U7.P15 24.17,44.53 22.43,44.53 v22.23,44.32
  Bottom 0.203: v34.67,37.16 34.67,41.28 31.37,44.58 22.48,44.58 v22.23,44.32
N$27  (via drill 0.38)
  Top 0.203: 21.75,10.83 v21.72,10.79 21.88,10.95 U6.P$5 | v19.89,13.16 19.52,13.16 R22.1
  Top 0.406: R22.1 18.96,11.74 R21.1
  Bottom 0.203: v21.72,10.79 22.48,11.56 22.48,12.57 21.89,13.16 v19.89,13.16
N$28
  Top 0.305: U7.P14 24.87,44.93 25.27,45.34 28.89,45.34 C24.1
N$29
  Top 0.61: D4.C 28.07,6.22 27.05,5.21 25.78,5.21 25.27,4.7 25.27,3.56 NEBULA1.3.3V
N$30
  Top 0.203: U9.3 31.92,32.19 32.56,31.55 37.97,31.55 38.28,31.24 R16.2
N$31  (via drill 0.38)
  Top 0.203: v27.66,14.27 R9.2 R20.1 | U6.P$8 28.94,11.95 v29.59,11.3
  Bottom 0.203: v27.66,14.27 27.66,13.23 v29.59,11.3
N$32
  Top 0.305: LED1.C R9.1
N$33
  Top 0.406: R22.2 17.66,13.94 LED2.C
N$34  (via drill 0.38)
  Top 0.203: X1.1 35.94,37.61 | v29.34,40 29.34,38.73 R6.1 R1.1
  Top 0.305: U7.P18 22.31,42.2 v22.23,42.29
  Top 0.406: 32.07,36.26 C25.1 | R11.2 32.07,37.41 32.07,36.26 | 32.07,36.26 32.13,36.19 v33.15,36.19
  Top 0.508: 35.69,36.96 36.34,37.61 X1.1
  Top 0.61: v33.15,36.19 v34.16,36.19 34.92,36.19 35.69,36.96 | D1.A v26.04,7.49
  Bottom 0.203: v29.34,40 29.34,39.88 29.97,39.24 31.88,39.24 | 32.13,39.24 32.39,39.24 | 31.88,39.24 32.13,39.24 | 31.88,39.24 32.39,39.75 | 32.39,38.73 31.88,39.24 | 32.39,38.99 32.13,39.24 | 32.13,39.24 32.39,39.5
  Bottom 0.305: v33.15,36.19 32.39,36.96 32.39,38.73 32.39,38.99 32.39,39.24 32.39,39.5 32.39,39.75 32.39,41.78 30.61,43.56 23.5,43.56 v22.23,42.29
  Bottom 0.61: v26.04,7.49 26.67,6.86 35.81,6.86 41.02,12.06 41.02,32.39 37.21,36.19 v34.16,36.19 v33.15,36.19
N$35
  Top 0.203: LED5.C 28.67,26.41 R8.1
N$36  (via drill 0.38)
  Top 0.203: X1.3 33.78,37.67 v33.6,37.67 | U7.P16 22.42,43.5 v22.23,43.31
  Bottom 0.203: v22.23,43.31 22.99,44.07 31.11,44.07 33.6,41.58 v33.6,37.67
N$37
  Top 0.203: LED4.C 29.46,25.82 R5.1
N$38
  Top 0.203: 23.75,6.1 23.75,6.12 D2.A
  Top 0.61: 20.7,4.03 NEBULA1.5V 20.57,3.9 20.57,4.95 21.72,6.1 23.75,6.1
OSC32_IN
  Top 0.203: U3.3 14.45,26.29 13.33,26.29 | 12.83,26.29 10.18,26.29 Q2.P$2 | 12.83,26.29 13.08,26.29 | 13.08,26.29 13.33,26.29 | C10.1 13.08,26.99 13.08,26.54 | 13.08,26.29 13.08,26.54 | 12.83,26.29 13.08,26.54 | 13.08,26.54 13.33,26.29
OSC32_OUT
  Top 0.203: U3.4 11.78,25.75 11.05,25.02 8.15,25.02 Q2.P$1 6.73,26.44 C11.1
OSC_IN
  Top 0.203: U3.5 11.89,25.25 11.23,24.58 11.16,24.51 | 11.16,24.51 C8.1 | Q1.1 7.23,24 7.75,24.51 11.16,24.51
OSC_OUT
  Top 0.203: Q1.3 10.15,19.41 C9.1 11.16,20.05 11.56,20.45 11.56,24.26 12.06,24.77 14.47,24.77 U3.6
RF24_CS
  Top 0.203: U3.52 22.44,28.36 22.99,27.81 24.51,27.81 25.02,28.32 25.02,29.08 25.53,29.59 30.1,29.59 32.39,27.3 32.39,26.29 32.64,26.04 33.14,26.04 U1.2
RF24_EN
  Top 0.203: U3.51 22.94,28.49 23.24,28.19 24.13,28.19 24.51,28.57 24.51,29.34 25.27,30.1 30.35,30.1 33.15,27.3 U1.1
RF24_IRQ
  Top 0.203: U1.6 33.16,22.74 31.36,22.74 30.86,23.25 U3.40
RF24_MISO  (via drill 0.38)
  Top 0.203: 33.14,24.51 U1.5 33.15,24.52 v32.13,23.5 | U3.27 21.44,16.66 v21.72,16.38
  Bottom 0.203: v32.13,23.5 31.88,23.24 31.88,20.95 29.85,18.92 27.81,18.92 26.04,17.14 22.48,17.14 v21.72,16.38
RF24_MOSI  (via drill 0.38)
  Top 0.203: v32.13,24.51 32.64,25.02 33.14,25.02 U1.4 | U3.28 21.94,18.7 21.46,19.18 v20.95,19.18
  Bottom 0.203: v20.95,19.18 20.95,18.67 21.97,17.65 25.78,17.65 27.56,19.43 29.59,19.43 31.37,21.21 31.37,23.75 v32.13,24.51
RF24_SCK  (via drill 0.38)
  Top 0.203: U3.53 21.94,27.84 v22.48,27.3 | v32.13,25.53 U1.3
  Bottom 0.203: v32.13,25.53 31.88,25.53 30.86,24.51 30.86,21.46 29.34,19.94 27.3,19.94 25.53,18.16 22.23,18.16 21.72,18.67 21.72,19.68 25.02,22.99 25.02,24.77 v22.48,27.3
RST  (via drill 0.38)
  Top 0.203: U4.7 25.25,32.92 26.49,34.16 26.8,34.16 27.3,34.67 27.3,37.47 26.8,37.97 25.27,37.97 24.51,38.73 23.5,38.73 22.48,37.72 20.95,37.72 19.68,36.45 18.92,36.45 16.38,33.91 14.61,33.91 | U3.7 15.36,24.25 16.13,25.02 v16.13,26.04 | R3.1 C12.1 14.1,31.94 14.1,33.4 | v14.1,33.91 14.61,33.91 | v14.1,33.91 13.59,33.91 | v14.1,33.91 14.1,33.4 | 14.61,33.91 14.1,33.4 | 13.59,33.91 14.1,33.4 | 13.59,33.91 12.7,33.91 S1.1
  Bottom 0.203: v14.1,33.91 14.1,32.89 16.13,30.86 v16.13,26.04
RX1  (via drill 0.38)
  Top 0.203: U3.43 21.23,24.75 v21.21,24.77
  Bottom 0.203: v21.21,24.77 20.19,25.78 20.19,33.4 21.21,34.42 21.21,40.26 20.45,41.02 20.45,45.08 21.46,46.1 24,46.1 25.29,47.39 NEBULA1.COM1_RX
RX2  (via drill 0.38)
  Top 0.203: U3.17 15.55,17.79 v15.21,18.14
  Bottom 0.203: v15.21,18.14 7.39,18.14 5.08,20.45 NEBULA1.COM2_RX
T0  (via drill 0.38)
  Top 0.203: U3.58 19.44,33.92 v19.68,34.16
  Bottom 0.203: NEBULA1.T0 22.11,47.52 19.94,45.34 19.94,40.77 20.7,40 20.7,34.92 19.94,34.16 v19.68,34.16
T1  (via drill 0.38)
  Top 0.203: U3.59 18.94,34.44 v19.68,35.18
  Bottom 0.203: NEBULA1.T1 20.21,46.37 19.43,45.59 19.43,40.51 20.19,39.75 20.19,35.69 v19.68,35.18
T2  (via drill 0.38)
  Top 0.203: U3.61 17.94,28.29 v18.41,27.81
  Bottom 0.203: v18.41,27.81 17.65,28.57 17.65,47.5 NEBULA1.T2
T3  (via drill 0.38)
  Top 0.203: U3.62 17.44,27.86 v17.4,27.81
  Bottom 0.203: NEBULA1.T3 15.88,45.59 17.14,44.32 17.14,28.07 v17.4,27.81
TA0  (via drill 0.38)
  Top 0.203: U3.22 18.94,17.16 v18.29,16.51
  Bottom 0.203: v18.29,16.51 17.53,15.75 16.76,15.75 16.13,16.38 8.96,16.38 NEBULA1.TA0
TA1
  Top 0.203: U3.23 19.44,16.39 18.67,15.62 17.14,15.62 15.62,17.14 12.57,17.14 8.69,13.26 NEBULA1.TA1
TEMP  (via drill 0.38)
  Top 0.203: U5.2 31.94,20 v32.64,20.7 | U3.26 20.94,14.62 v20.95,14.61
  Bottom 0.203: v20.95,14.61 21.97,14.61 22.48,15.11 22.48,16.13 22.99,16.64 26.29,16.64 28.07,18.41 30.1,18.41 32.39,20.7 v32.64,20.7
TX1  (via drill 0.38)
  Top 0.203: U3.42 23.74,24.25 v22.99,23.5
  Bottom 0.203: NEBULA1.COM1_TX 25.91,45.59 21.72,45.59 20.95,44.83 20.95,41.28 21.72,40.51 21.72,34.16 20.7,33.15 20.7,26.29 22.99,24 v22.99,23.5
TX2  (via drill 0.38)
  Top 0.203: v13.28,19.74 v13.29,19.75 U3.16
  Bottom 0.203: NEBULA1.COM2_TX 4.44,22.99 7.7,19.74 v13.28,19.74

### Text on the board
bTest: Design By: | Pygmy Nebula | Evan Teitelman | Warren D Greenway | V1 Rev2 | 1000mA Max | 3.7V LiPo